# EAGLE design main (EAGLE 9.3.0)
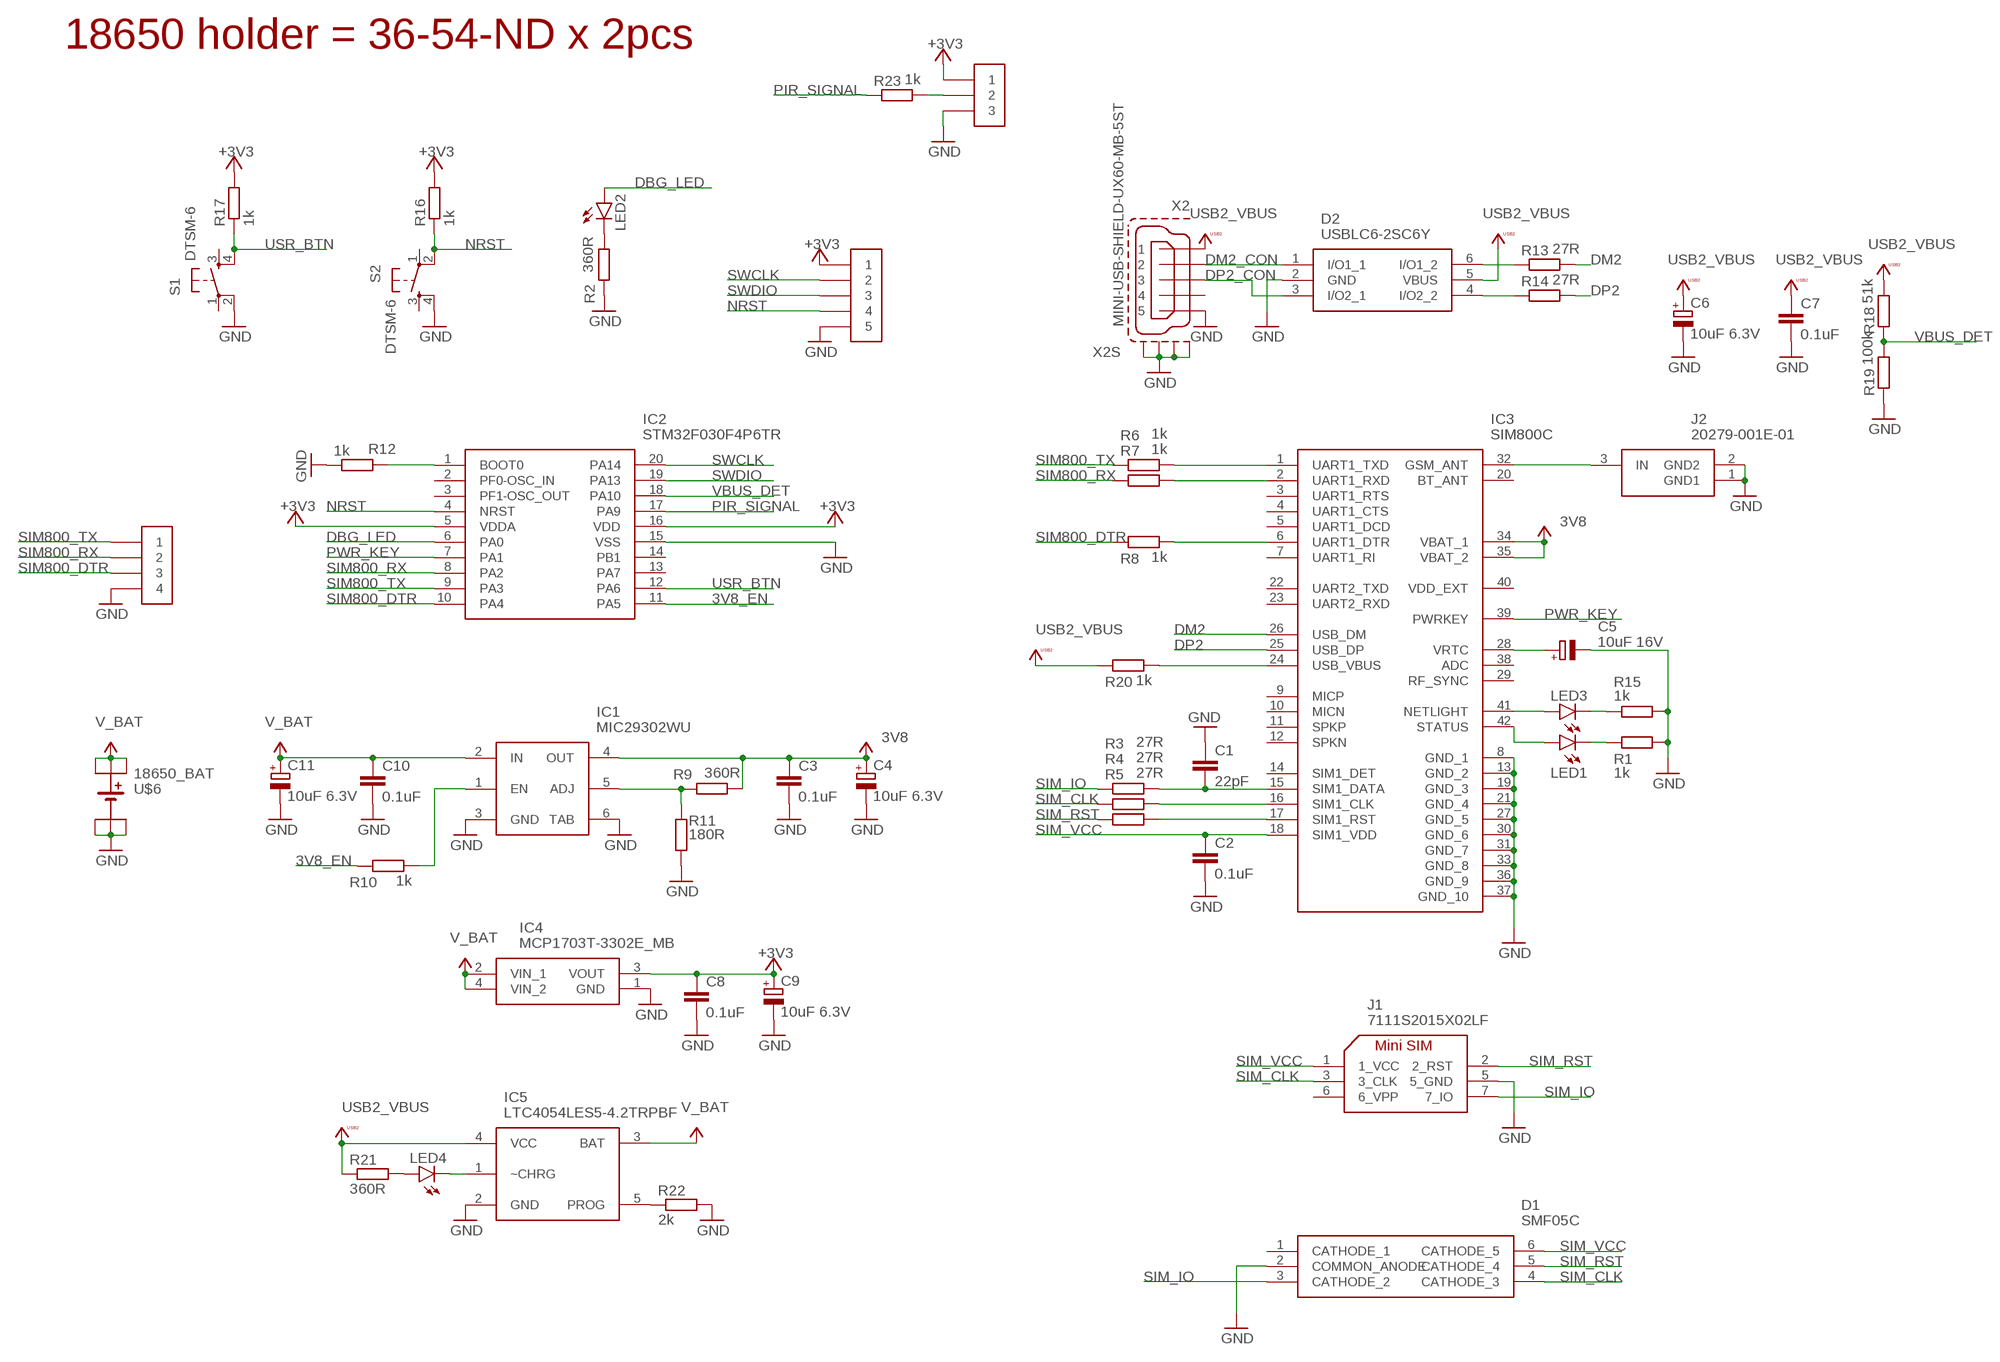
[diagram p0: schematic, sheet 1]

## Parts
C1  22pF  C-EUC0805  [C0805]
C2  0.1uF  C-EUC0805  [C0805]
C3  0.1uF  C-EUC0805  [C0805]
C4  10uF 6.3V  CPOL-EUSMCC  [SMC_C]
C5  10uF 16V  CPOL-EUSMCC  [SMC_C]
C6  10uF 6.3V  CPOL-EUSMCC  [SMC_C]
C7  0.1uF  C-EUC0805  [C0805]
C8  0.1uF  C-EUC0805  [C0805]
C9  10uF 6.3V  CPOL-EUSMCC  [SMC_C]
C10  0.1uF  C-EUC0805  [C0805]
C11  10uF 6.3V  CPOL-EUSMCC  [SMC_C]
D1  SMF05C  [SOT65P210X110-6N]
D2  USBLC6-2SC6Y  [SOT95P280X145-6N]
IC1  MIC29302WU  [MIC29302WU]
IC2  STM32F030F4P6TR  [SOP65P640X120-20N]
IC3  SIM800C  [SIM800C]
IC4  MCP1703T-3302E_MB  [SOT-89(MB)]
IC5  LTC4054LES5-4.2TRPBF  [SOT95P280X100-5N]
J1  7111S2015X02LF  [7111S2015X02LF]
J2  20279-001E-01  [20279-001E-01]
LED1  LEDCHIPLED_0805  [CHIPLED_0805]
LED2  LEDCHIPLED_0805  [CHIPLED_0805]
LED3  LEDCHIPLED_0805  [CHIPLED_0805]
LED4  LEDCHIPLED_0805  [CHIPLED_0805]
R1  1k  R-EU_R0805  [R0805]
R2  360R  R-EU_R0805  [R0805]
R3  27R  R-EU_R0805  [R0805]
R4  27R  R-EU_R0805  [R0805]
R5  27R  R-EU_R0805  [R0805]
R6  1k  R-EU_R0805  [R0805]
R7  1k  R-EU_R0805  [R0805]
R8  1k  R-EU_R0805  [R0805]
R9  360R  R-EU_R0805  [R0805]
R10  1k  R-EU_R0805  [R0805]
R11  180R  R-EU_R0805  [R0805]
R12  1k  R-EU_R0805  [R0805]
R13  27R  R-EU_R0805  [R0805]
R14  27R  R-EU_R0805  [R0805]
R15  1k  R-EU_R0805  [R0805]
R16  1k  R-EU_R0805  [R0805]
R17  1k  R-EU_R0805  [R0805]
R18  51k  R-EU_R0805  [R0805]
R19  100k  R-EU_R0805  [R0805]
R20  1k  R-EU_R0805  [R0805]
R21  360R  R-EU_R0805  [R0805]
R22  2k  R-EU_R0805  [R0805]
R23  1k  R-EU_R0805  [R0805]
S1  DTSM-6  [DTSM-6]
S2  DTSM-6  [DTSM-6]
U$5  1R_4P  [1R_4P]
U$6  18650_BAT  [18650_BAT]
U$12  1R_5P  [1R_5P]
U$15  1R_3P  [1R_3P]
X2  MINI-USB-SHIELD-UX60-MB-5ST  [UX60-MB-5ST]

## Nets
3V8: C3.1 C4.+ IC1.4(OUT) IC3.34(VBAT_1) IC3.35(VBAT_2) R9.2
3V8_EN: IC2.11(PA5) R10.1
+3V3: C8.1 C9.+ IC2.5(VDDA) IC2.16(VDD) IC4.3(VOUT) R16.2 R17.2 U$12.P$1 U$15.P$1
DBG_LED: IC2.6(PA0) LED2.A
DM2: IC3.26(USB_DM) R13.2
DM2_CON: D2.1(I/O1_1) X2.2
DP2: IC3.25(USB_DP) R14.2
DP2_CON: D2.3(I/O2_1) X2.3
GND: C1.1 C2.2 C3.2 C4.- C5.- C6.- C7.2 C8.2 C9.- C10.2 C11.- D1.2(COMMON_ANODE) D2.2(GND) IC1.3(GND) IC1.6(TAB) IC2.15(VSS) IC3.8(GND_1) IC3.13(GND_2) IC3.19(GND_3) IC3.21(GND_4) IC3.27(GND_5) IC3.30(GND_6) IC3.31(GND_7) IC3.33(GND_8) IC3.36(GND_9) IC3.37(GND_10) IC4.1(GND) IC5.2(GND) J1.5(5_GND) J2.1(GND1) J2.2(GND2) R1.2 R2.1 R11.1 R12.2 R15.2 R19.1 R22.2 S1.2 S2.4 U$5.P$4 U$6.4 U$6.5 U$6.6 U$12.P$5 U$15.P$3 X2.5 X2.M1(S1) X2.M2(S2) X2.M3(S3) X2.M4(S4)
N$1: IC3.41(NETLIGHT) LED3.A
N$2: LED3.C R15.1
N$3: IC3.42(STATUS) LED1.A
N$4: LED1.C R1.1
N$5: IC3.32(GSM_ANT) J2.3(IN)
N$6: C5.+ IC3.28(VRTC)
N$7: C1.2 IC3.15(SIM1_DATA) R3.2
N$8: IC3.16(SIM1_CLK) R4.2
N$9: IC3.17(SIM1_RST) R5.2
N$10: IC2.1(BOOT0) R12.1
N$11: IC3.1(UART1_TXD) R6.2
N$12: IC3.2(UART1_RXD) R7.2
N$13: IC3.6(UART1_DTR) R8.2
N$14: IC1.1(EN) R10.2
N$15: D2.6(I/O1_2) R13.1
N$16: IC1.5(ADJ) R9.1 R11.2
N$17: LED2.C R2.2
N$18: IC3.24(USB_VBUS) R20.2
N$19: D2.4(I/O2_2) R14.1
N$20: LED4.A R21.2
N$21: IC5.1(~CHRG) LED4.C
N$22: IC5.5(PROG) R22.1
N$23: R23.2 U$15.P$2
NRST: IC2.4(NRST) R16.1 S2.2 U$12.P$4
PIR_SIGNAL: IC2.17(PA9) R23.1
PWR_KEY: IC2.7(PA1) IC3.39(PWRKEY)
SIM800_DTR: IC2.10(PA4) R8.1 U$5.P$3
SIM800_RX: IC2.8(PA2) R7.1 U$5.P$2
SIM800_TX: IC2.9(PA3) R6.1 U$5.P$1
SIM_CLK: D1.4(CATHODE_3) J1.3(3_CLK) R4.1
SIM_IO: D1.3(CATHODE_2) J1.7(7_IO) R3.1
SIM_RST: D1.5(CATHODE_4) J1.2(2_RST) R5.1
SIM_VCC: C2.1 D1.6(CATHODE_5) IC3.18(SIM1_VDD) J1.1(1_VCC)
SWCLK: IC2.20(PA14) U$12.P$2
SWDIO: IC2.19(PA13) U$12.P$3
USB2_VBUS: C6.+ C7.1 D2.5(VBUS) IC5.4(VCC) R18.2 R20.1 R21.1 X2.1
USR_BTN: IC2.12(PA6) R17.1 S1.4
V_BAT: C10.1 C11.+ IC1.2(IN) IC4.2(VIN_1) IC4.4(VIN_2) IC5.3(BAT) U$6.1 U$6.2 U$6.3
VBUS_DET: IC2.18(PA10) R18.1 R19.2
Unconnected: D1.1(CATHODE_1) IC2.2(PF0-OSC_IN) IC2.3(PF1-OSC_OUT) IC2.13(PA7) IC2.14(PB1) IC3.3(UART1_RTS) IC3.4(UART1_CTS) IC3.5(UART1_DCD) IC3.7(UART1_RI) IC3.9(MICP) IC3.10(MICN) IC3.11(SPKP) IC3.12(SPKN) IC3.14(SIM1_DET) IC3.20(BT_ANT) IC3.22(UART2_TXD) IC3.23(UART2_RXD) IC3.29(RF_SYNC) IC3.38(ADC) IC3.40(VDD_EXT) J1.6(6_VPP) S1.1 S1.3 S2.1 S2.3 X2.4

## Notes on the sheet
- 18650 holder = 36-54-ND x 2pcs

## Library data of the parts
C1-C3 C7 C8 C10 = rcl:C-EU: CAPACITOR, European symbol; SPICEPREFIX: C
C4-C6 C9 C11 = rcl:CPOL-EU: POLARIZED CAPACITOR, European symbol; SPICEPREFIX: C
D1 = SMF05C:SMF05C: SEMTECH - SMF05C - DIODE, TVS, 5 CH, BIDIR, 5V, SC70 Source: Datasheet <https://componentsearchengine.com/Datasheets/2/SMF05C.pdf>; DESCRIPTION: SEMTECH - SMF05C - DIODE, TVS, 5 CH, BIDIR, 5V, SC70; HEIGHT: 1.1mm; MANUFACTURER_NAME: SEMTECH; MANUFACTURER_PART_NUMBER: SMF05C
D2 = USBLC6-2SC6Y:USBLC6-2SC6Y: Low Cap. ESD Protection Auto SOT-23-6 STMicroelectronics USBLC6-2SC6Y, Dual Uni-Directional TVS Diode Array, 6-Pin SOT-23 Source: Datasheet <https://componentsearchengine.com/Datasheets/1/USBLC6-2SC6Y.pdf>; DESCRIPTION: Low Cap. ESD Protection Auto SOT-23-6 STMicroelectronics USBLC6-2SC6Y, Dual Uni-Directional TVS Diode Array, 6-Pin SOT-23; HEIGHT: 1.45mm; MANUFACTURER_NAME: STMicroelectronics; MANUFACTURER_PART_NUMBER: USBLC6-2SC6Y; MOUSER_PART_NUMBER: 511-USBLC6-2SC6Y; MOUSER_PRICE-STOCK: https://www.mouser.com/Search/Refine.aspx?Keyword=511-USBLC6-2SC6Y; RS_PART_NUMBER: 1655549; RS_PRICE-STOCK: http://uk.rs-online.com/web/p/products/1655549
IC1 = MIC29302WU:MIC29302WU: Microchip MIC29302WU, LDO Regulator, 3A Adjustable, 1.25 26 V, +/-1% 5-Pin D2PAK Source: Datasheet <http://ww1.microchip.com/downloads/en/DeviceDoc/20005685A.pdf>; DESCRIPTION: Microchip MIC29302WU, LDO Regulator, 3A Adjustable, 1.25 26 V, +/-1% 5-Pin D2PAK; HEIGHT: 4mm; MANUFACTURER_NAME: Microchip; MANUFACTURER_PART_NUMBER: MIC29302WU; MOUSER_PART_NUMBER: 998-MIC29302WU; RS_PART_NUMBER: 9101607P; RS_PRICE-STOCK: http://uk.rs-online.com/web/p/products/9101607P
IC2 = STM32F030F4P6TR:STM32F030F4P6TR: 32-Bit MCU Cortex-M0 16K Flash TSSOP20 32-Bit MCU Cortex-M0 16K Flash TSSOP20 Source: Datasheet <http://www.st.com/web/en/resource/technical/document/datasheet/DM00088500.pdf>; ALLIED_NUMBER: 70521133; ALLIED_PRICE-STOCK: http://www.alliedelec.com/stmicroelectronics-stm32f030f4p6tr/70521133/; DESCRIPTION: 32-Bit MCU Cortex-M0 16K Flash TSSOP20 32-Bit MCU Cortex-M0 16K Flash TSSOP20; HEIGHT: 1.2mm; MANUFACTURER_NAME: STMicroelectronics; MANUFACTURER_PART_NUMBER: STM32F030F4P6TR; MOUSER_PART_NUMBER: 511-STM32F030F4P6TR; MOUSER_PRICE-STOCK: https://www.mouser.com/Search/Refine.aspx?Keyword=511-STM32F030F4P6TR; RS_PART_NUMBER: 1688744; RS_PRICE-STOCK: http://uk.rs-online.com/web/p/products/1688744
IC3 = sim800c:SIM800C: Quad-band GSM/GPRS wireless module Source: Datasheet <http://www.sabreadv.com/wp-content/uploads/SIM800C_Hardware_Design_V1.00.pdf>; DESCRIPTION: Quad-band GSM/GPRS wireless module; HEIGHT: mm; MANUFACTURER_NAME: SIMCOM; MANUFACTURER_PART_NUMBER: sim800c
IC4 = MCP1703T-3302E_MB:MCP1703T-3302E_MB: LDO Low Iq 250mA 16V 3.3V 2% SOT89 Microchip MCP1703T-3302E/MB, LDO Voltage Regulator, 250mA, 3.3 V 2%, 2.7 16 Vin, 3-Pin SOT-89 Source: Datasheet <http://ww1.microchip.com/downloads/en/DeviceDoc/22049f.pdf>; ALLIED_NUMBER: 70047986; ALLIED_PRICE-STOCK: https://www.alliedelec.com/microchip-technology-inc-mcp1703t-3302e-mb/70047986/; DESCRIPTION: LDO Low Iq 250mA 16V 3.3V 2% SOT89 Microchip MCP1703T-3302E/MB, LDO Voltage Regulator, 250mA, 3.3 V 2%, 2.7 16 Vin, 3-Pin SOT-89; HEIGHT: mm; MANUFACTURER_NAME: Microchip; MANUFACTURER_PART_NUMBER: MCP1703T-3302E/MB; MOUSER_PART_NUMBER: 579-MCP1703T-3302EMB; MOUSER_PRICE-STOCK: https://www.mouser.com/Search/Refine.aspx?Keyword=579-MCP1703T-3302EMB; RS_PART_NUMBER: 9122916; RS_PRICE-STOCK: http://uk.rs-online.com/web/p/products/9122916
IC5 = LTC4054LES5-4.2TRPBF:LTC4054LES5-4.2TRPBF: Standalone Linear Li-Ion Battery Charger with Thermal Regulation Source: Datasheet; DESCRIPTION: Standalone Linear Li-Ion Battery Charger with Thermal Regulation; HEIGHT: mm; MANUFACTURER_NAME: Linear Technology; MANUFACTURER_PART_NUMBER: LTC4054LES5-4.2TRPBF
J1 = 7111S2015X02LF:7111S2015X02LF: Amphenol FCI Horizontal Surface Mount Memory & SIM Card Connector, with Solder Termination Source: Datasheet <http://portal.fciconnect.com/Comergent//fci/drawing/vjw54355.pdf>; ALLIED_NUMBER: 70248487; ALLIED_PRICE-STOCK: https://www.alliedelec.com/amphenol-fci-7111s2015x02lf/70248487/; DESCRIPTION: Amphenol FCI Horizontal Surface Mount Memory & SIM Card Connector, with Solder Termination; HEIGHT: mm; MANUFACTURER_NAME: FCI; MANUFACTURER_PART_NUMBER: 7111S2015X02LF; MOUSER_PART_NUMBER: 649-7111S2015X02LF; MOUSER_PRICE-STOCK: https://www.mouser.com/Search/Refine.aspx?Keyword=649-7111S2015X02LF; RS_PART_NUMBER: 1708857; RS_PRICE-STOCK: http://uk.rs-online.com/web/p/products/1708857
J2 = 20279-001E-01:20279-001E-01: I-Pex Straight 50 Surface Mount UHF Connector, jack, Solder Termination, Coaxial Source: Datasheet <http://uk.rs-online.com/web/p/products/7138874>; DESCRIPTION: I-Pex Straight 50 Surface Mount UHF Connector, jack, Solder Termination, Coaxial; HEIGHT: mm; MANUFACTURER_NAME: I-Pex; MANUFACTURER_PART_NUMBER: 20279-001E-01; RS_PART_NUMBER: 7138874P; RS_PRICE-STOCK: http://uk.rs-online.com/web/p/products/7138874P
LED1-LED4 = led:LED: LED OSRAM: - CHIPLED LG R971, LG N971, LY N971, LG Q971, LY Q971, LO R971, LY R971 LH N974, LH R974 LS Q976, LO Q976, LY Q976 LO Q996 - Hyper CHIPLED LW Q18S LB Q993, LB Q99A, LB R99A - SideLED LS A670, LO A670, LY A670, LG A670, LP A670 LB A673, LV A673, LT A673, LW A673 LH A674 LY A675 LS A676, LA A676, LO A676, LY A676, LW A676 LS A679, LY A679, LG A679 - Hyper Micro SIDELED® LS Y876, LA Y876, LO Y876, LY Y876 LT Y87S - SmartLED LW L88C, LW L88S LB L89C, LB L89S, LG L890 LS L89K, LO L89K, LY L89K LS L896, LA L896, LO L896, LY L896 - TOPLED LS T670, LO T670, LY T670, LG T670, LP T670 LSG T670, LSP T670, LSY T670, LOP T670, LYG T670 LG T671, LOG T671, LSG T671 LB T673, LV T673, LT T673, LW T673 LH T674 LS T676, LA T676, LO T676, LY T676, LB T676, LH T676, LSB T676, LW T676 LB T67C, LV T67C, LT T67C, LS T67K, LO T67K, LY T67K, LW E67C LS E67B, LA E67B, LO E67B, LY E67B, LB E67C, LV E67C, LT E67C LW T67C LS T679, LY T679, LG T679 LS T770, LO T770, LY T770, LG T770, LP T770 LB T773, LV T773, LT T773, LW T773 LH T774 LS E675, LA E675, LY E675, LS T675 LS T776, LA T776, LO T776, LY T776, LB T776 LHGB T686 LT T68C, LB T68C - Hyper Mini TOPLED® LB M676 - Mini TOPLED Santana® LG M470 LS M47K, LO M47K, LY M47K Source: http://www.osram.convergy.de LUXEON: - LUMILED® LXK2-PW12-R00, LXK2-PW12-S00, LXK2-PW14-U00, LXK2-PW14-V00 LXK2-PM12-R00, LXK2-PM12-S00, LXK2-PM14-U00 LXK2-PE12-Q00, LXK2-PE12-R00, LXK2-PE12-S00, LXK2-PE14-T00, LXK2-PE14-U00 LXK2-PB12-K00, LXK2-PB12-L00, LXK2-PB12-M00, LXK2-PB14-N00, LXK2-PB14-P00, LXK2-PB14-Q00 LXK2-PR12-L00, LXK2-PR12-M00, LXK2-PR14-Q00, LXK2-PR14-R00 LXK2-PD12-Q00, LXK2-PD12-R00, LXK2-PD12-S00 LXK2-PH12-R00, LXK2-PH12-S00 LXK2-PL12-P00, LXK2-PL12-Q00, LXK2-PL12-R00 Source: www.luxeon.com KINGBRIGHT: KA-3528ASYC Source: www.kingbright.com
R1-R23 = rcl:R-EU_: RESISTOR, European symbol; SPICEPREFIX: R
S1 S2 = switch-tact:DTSM-6
U$5 = PLS PLD pins:1R_4P
U$6 = 18650_holder:18650_BAT
U$12 = PLS PLD pins:1R_5P
U$15 = PLS PLD pins:1R_3P
X2 = 10033526-N3212MLF:MINI-USB-SHIELD-: MINI USB B CONN You can use either component with this footprint: http://files.edac.net/690-005-299-043.pdf https://www.amphenol-icc.com/media/wysiwyg/files/drawing/10033526.pdf; OC_FARNELL: unknown; OC_NEWARK: unknown

## Board
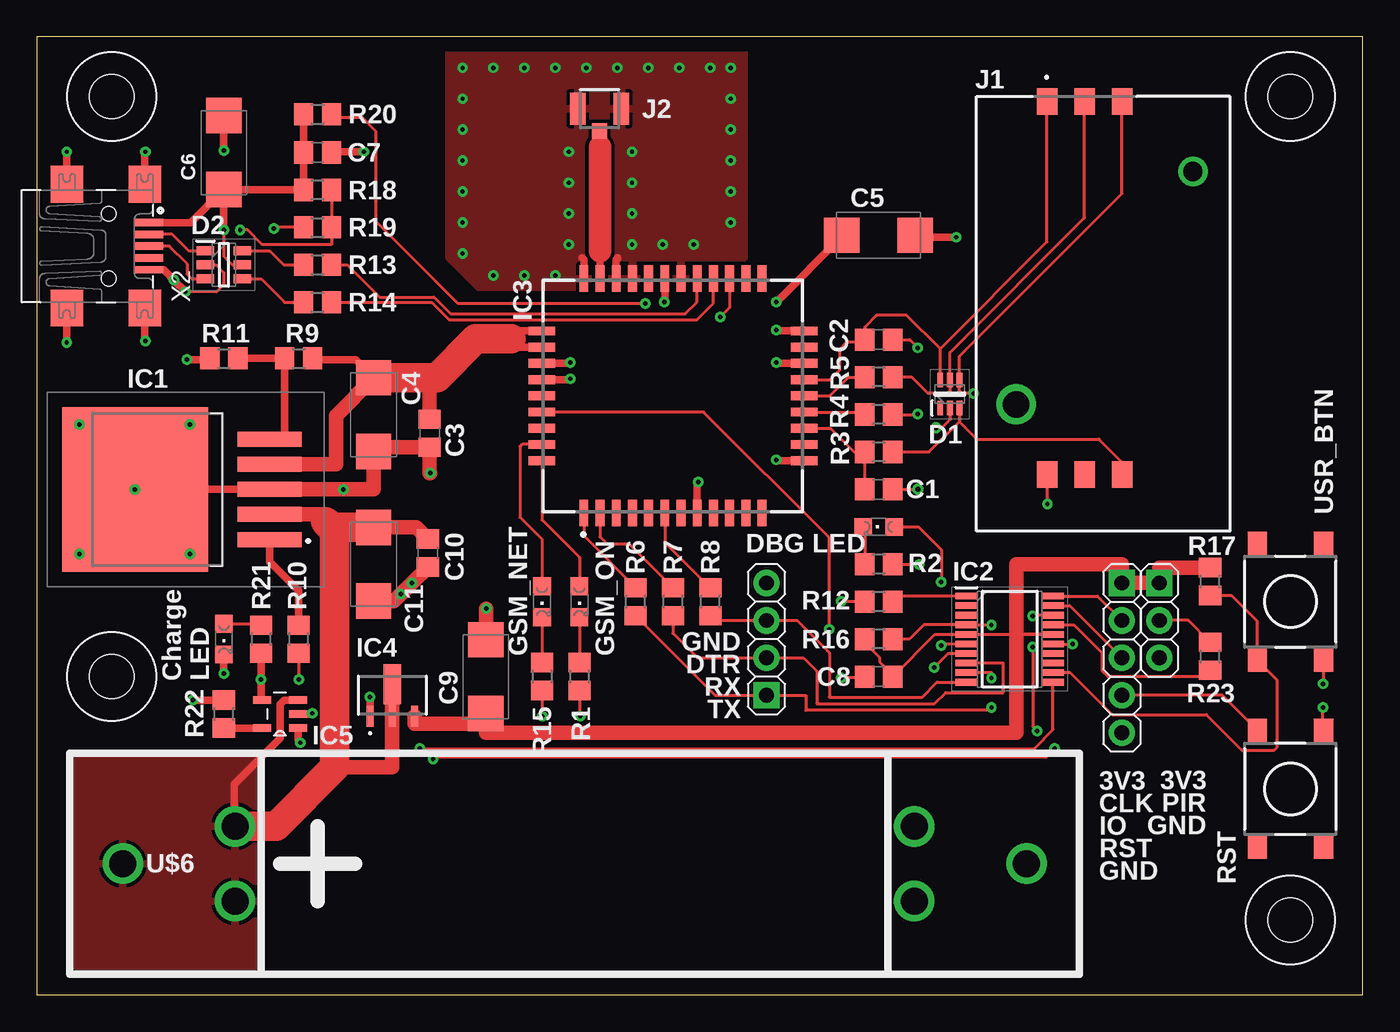
[diagram p1: board, top side]
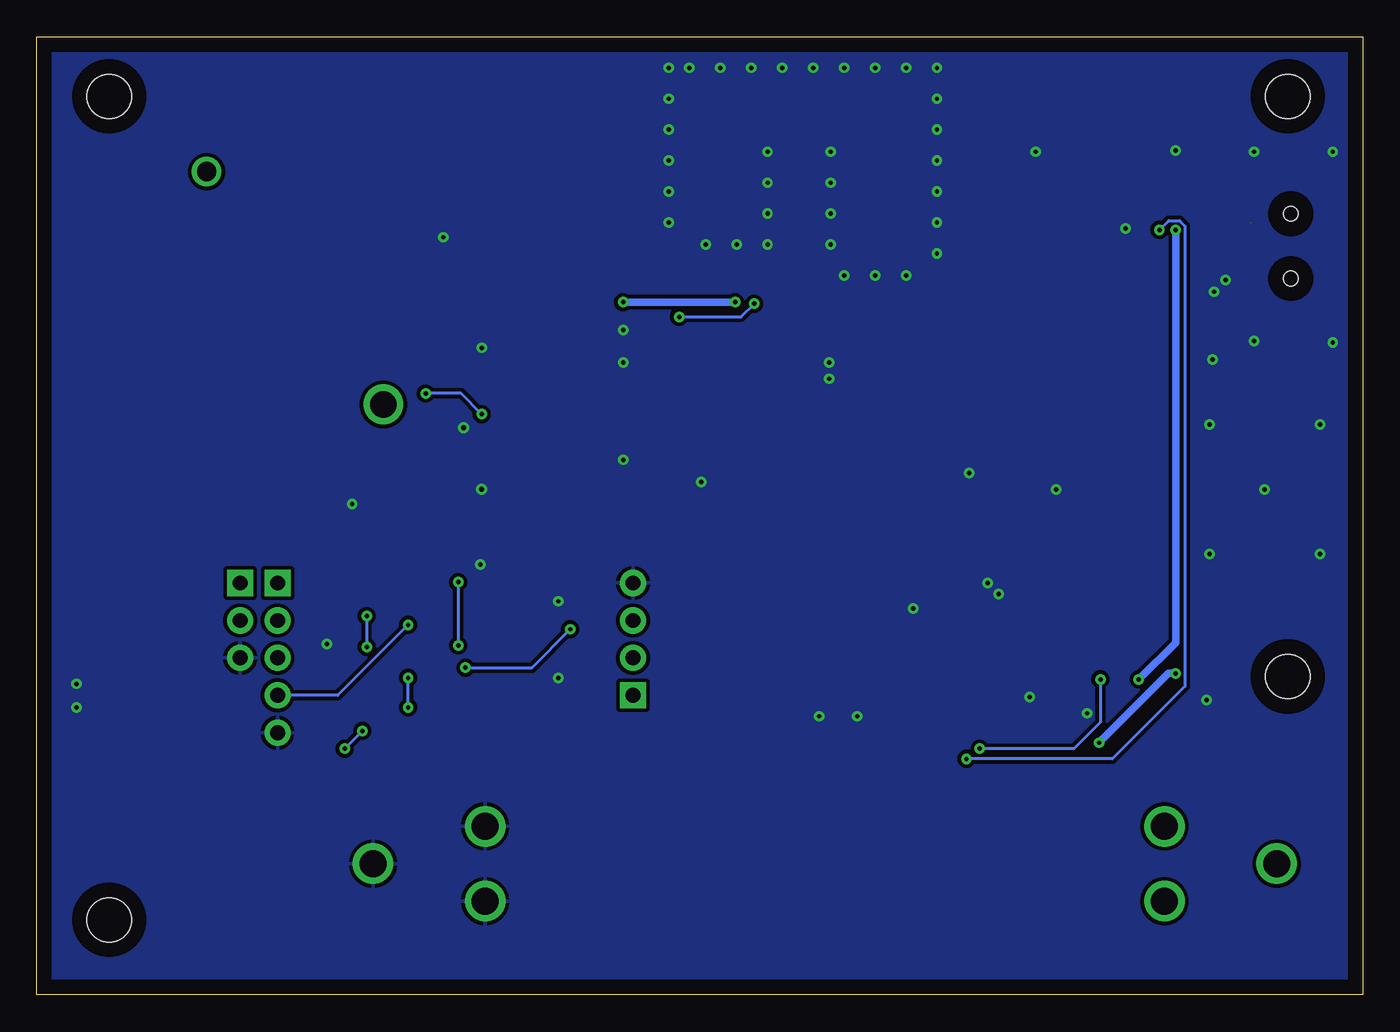
[diagram p2: board, bottom side, seen from below]

Size 90 x 65 mm. Coordinates in mm from the lower left corner, seen from the top.
Outline: 0,0 90,0 90,65 0,65 0,0
Copper layers (1*16): Top 0.035mm / dielectric 1.5mm / Bottom 0.035mm
Design rules "default *": minimum track width 6mil, minimum drill 0.35mm, track to track 6mil, track to pad 6mil, pad to pad 6mil, via to via 6mil, smd to smd 6mil, copper to edge 40mil, drill to drill 6mil, minimum pad ring 10mil, minimum via ring 8mil, stop-mask expansion 4mil, vias tented up to drill 0.35mm, thermal gap 10mil
Holes 3 mm at 5.08,21.59 85.09,5.08 5.08,60.96 85.09,60.96

### Footprints (pad centres in the part's own frame; a part is rotated, then mirrored left to right if it is on the bottom)
C0805 = smd 1.3 x 1.5: 1 -0.95,0; 2 0.95,0
SMC_C = smd 2.4 x 2.4: + -2.5,0; - 2.5,0
SOT65P210X110-6N = smd 1 x 0.4: 1 -0.95,0.65; 2 -0.95,0; 3 -0.95,-0.65; 4 0.95,-0.65; 5 0.95,0; 6 0.95,0.65
SOT95P280X145-6N = smd 1.2 x 0.6: 1 -1.25,0.95; 2 -1.25,0; 3 -1.25,-0.95; 4 1.25,-0.95; 5 1.25,0; 6 1.25,0.95
MIC29302WU = smd 1.02 x 4.32: 1 -3.4,-12; 2 -1.7,-12; 3 0,-12; 4 1.7,-12; 5 3.4,-12 | smd 11.18 x 9.91: 6 0,-2.855
SOP65P640X120-20N = smd 1.475 x 0.45: 1 -2.938,2.925; 2 -2.938,2.275; 3 -2.938,1.625; 4 -2.938,0.975; 5 -2.938,0.325; 6 -2.938,-0.325; 7 -2.938,-0.975; 8 -2.938,-1.625; 9 -2.938,-2.275; 10 -2.938,-2.925; 11 2.938,-2.925; 12 2.938,-2.275; 13 2.938,-1.625; 14 2.938,-0.975; 15 2.938,-0.325; 16 2.938,0.325; 17 2.938,0.975; 18 2.938,1.625; 19 2.938,2.275; 20 2.938,2.925
SIM800C = smd 1.8 x 0.6: 1 -7.95,6.05; 2 -7.95,4.95; 3 -7.95,3.85; 4 -7.95,2.75; 5 -7.95,1.65; 6 -7.95,0.55; 7 -7.95,-0.55; 8 -7.95,-1.65; 9 -7.95,-2.75; 10 -7.95,-3.85; 11 -7.95,-4.95; 12 -7.95,-6.05; 22 7.95,-6.05; 23 7.95,-4.95; 24 7.95,-3.85; 25 7.95,-2.75; 26 7.95,-1.65; 27 7.95,-0.55; 28 7.95,0.55; 29 7.95,1.65; 30 7.95,2.75; 31 7.95,3.85; 32 7.95,4.95; 33 7.95,6.05 | smd 0.6 x 1.8: 13 -4.4,-8.9; 14 -3.3,-8.9; 15 -2.2,-8.9; 16 -1.1,-8.9; 17 0,-8.9; 18 1.1,-8.9; 19 2.2,-8.9; 20 3.3,-8.9; 21 4.4,-8.9; 34 4.4,8.9; 35 3.3,8.9; 36 2.2,8.9; 37 1.1,8.9; 38 0,8.9; 39 -1.1,8.9; 40 -2.2,8.9; 41 -3.3,8.9; 42 -4.4,8.9
SOT-89(MB) = smd 0.48 x 1.4: 1 -1.5,-1.425; 3 1.5,-1.425 | smd 0.48 x 1.525: 2 0,-1.363 | smd 1.2 x 2.725: 4 0,0.76
SOT95P280X100-5N = smd 1.219 x 0.508: 1 -1.219,0.94; 2 -1.219,0; 3 -1.219,-0.94; 4 1.219,-0.94; 5 1.219,0.94
7111S2015X02LF = smd 1.4 x 1.8: 1 -3.81,-0.35; 2 -1.27,-0.35; 3 1.27,-0.35; 5 -3.81,-25.65; 6 -1.27,-25.65; 7 1.27,-25.65 | drill 1.3 pad 2: H1 6.09,-5.1 | drill 1.8 pad 2.65: H2 -5.91,-20.9
20279-001E-01 = smd 2.2 x 1.05: 1 0,1.475; 2 0,-1.475 | smd 1.05 x 1: 3 1.525,0
CHIPLED_0805 = smd 1.2 x 1.2: A 0,-1.05; C 0,1.05
R0805 = smd 1.3 x 1.5: 1 -0.95,0; 2 0.95,0
DTSM-6 = smd 1.55 x 1.3: 1 -3.975,2.25; 2 3.975,2.25; 3 -3.975,-2.25; 4 3.975,-2.25
1R_4P = drill 1 pad 1.778 square: P$1 0,0 | drill 1 pad 1.778: P$2 2.54,0; P$3 5.08,0; P$4 7.62,0
18650_BAT = drill 1.83 pad 2.75: 1 -1.78,2.54; 2 -1.78,-2.54; 3 -9.4,0; 4 44.325,-2.54; 5 44.325,2.54; 6 51.945,0
1R_5P = drill 1 pad 1.778 square: P$1 0,0 | drill 1 pad 1.778: P$2 2.54,0; P$3 5.08,0; P$4 7.62,0; P$5 10.16,0
1R_3P = drill 1 pad 1.778 square: P$1 0,0 | drill 1 pad 1.778: P$2 2.54,0; P$3 5.08,0
UX60-MB-5ST = smd 2 x 0.5: 1 2.25,1.6; 2 2.25,0.8; 3 2.25,0; 4 2.25,-0.8; 5 2.25,-1.6 | smd 2.2 x 2.5: M1 -3.3,-4.2; M2 -3.3,4.2; M3 2,4.2; M4 2,-4.2 | hole 1: -0.45,2.2; -0.45,-2.2

### Placement (x,y rotation side)
C1  57.15,34.29 180 top
C2  57.15,44.45 0 top
C3  26.67,38.1 270 top
C4  22.86,39.37 270 top
C5  57.13,51.54 0 top
C6  12.7,57.15 90 top
C7  19.05,57.15 0 top
C8  57.15,21.59 180 top
C9  30.48,21.59 90 top
C10  26.54,29.97 270 top
C11  22.86,29.21 270 top
D1  61.97,40.76 90 top
D2  12.7,49.53 0 top
IC1  3.81,34.29 90 top
IC2  66.04,24.13 0 top
IC3  43.18,40.64 90 top
IC4  24.13,20.32 0 top
IC5  16.51,19.05 180 top
J1  72.39,60.96 0 top
J2  38.2,60.12 270 top
LED1  36.83,26.67 180 top
LED2  57.15,31.75 90 top
LED3  34.29,26.67 180 top
LED4  12.7,24.13 180 top
R1  36.83,21.59 270 top
R2  57.15,29.21 180 top
R3  57.15,36.83 180 top
R4  57.15,39.37 180 top
R5  57.15,41.91 180 top
R6  40.64,26.67 90 top
R7  43.18,26.67 90 top
R8  45.72,26.67 90 top
R9  17.78,43.18 0 top
R10  17.78,24.13 90 top
R11  12.7,43.18 0 top
R12  57.15,26.67 180 top
R13  19.05,49.53 0 top
R14  19.05,46.99 0 top
R15  34.29,21.59 270 top
R16  57.15,24.13 180 top
R17  79.64,28.04 90 top
R18  19.05,54.61 180 top
R19  19.05,52.07 0 top
R20  19.06,59.75 0 top
R21  15.24,24.13 90 top
R22  12.7,19.05 90 top
R23  79.64,22.96 90 top
S1  85.09,26.67 270 top
S2  85.09,13.97 90 top
U$5  49.53,20.32 90 top
U$6  15.24,8.89 0 top
U$12  73.66,27.94 270 top
U$15  76.2,27.94 270 top
X2  5.33,50.8 0 top

### Tracks (layer width: path | path; a pad name or v marks a point on that pad's centre or on a via)
3V8
  Top 0.5: IC3.35 31.16,43.94 30.06,45.04 | IC3.34 30.06,45.04 | R9.2 18.81,43.1 21.63,43.1 C4.+ | 30.06,45.04 30.06,44.76 29.8,44.5
  Top 1: IC1.4 20.3,35.99 20.3,39.3 C4.+ | C3.1 26.67,41.37 27.17,41.87
  Top 2: C4.+ 27.17,41.87 29.8,44.5 32.2,44.5
3V8_EN  (via drill 0.3)
  Top 0.2: R10.1 17.78,21.4 v17.8,21.4 | v26,16.7 67.7,16.7 69,18 68.98,18.02 IC2.11
  Bottom 0.2: v17.8,21.4 17.8,18.5 19.6,16.7 v26,16.7
+3V3
  Top 0.2: R16.2 56.2,23.9 57.2,22.9 57.2,22.6 58.1,21.7 C8.1 60.97,24.45 IC2.5 IC2.16 66.56,24.45 66.5,24.4
  Top 1: IC4.3 25.63,18.4 30.48,18.4 C9.+ 30.48,17.77 66.5,17.77 66.5,24.4 66.5,29.2 73.66,29.2 U$12.P$1 U$15.P$1 76.2,28.99 R17.2
DBG_LED  (via drill 0.3)
  Top 0.2: LED2.A 59.85,31.75 61.4,30.2 v61.4,28 | v61.4,23.7 61.51,23.8 IC2.6
  Bottom 0.2: v61.4,28 v61.4,23.7
DM2
  Top 0.2: R13.2 21.07,49.53 23.26,47.34 26.96,47.34 28.1,46.2 44,46.2 44.8,47 44.8,48.56 IC3.26
DM2_CON
  Top 0.2: D2.1 10.32,50.48 9.2,51.6 X2.2
DP2
  Top 0.2: R14.2 26.81,46.99 28,45.8 44.8,45.8 45.93,46.93 IC3.25
DP2_CON
  Top 0.2: D2.3 10.52,48.58 10.2,48.9 10.2,49.6 9,50.8 X2.3
GND  (via drill 0.3, 0.35)
  Top 0.2: C2.2 59.25,44.45 v59.8,43.9 | J1.5 68.58,33.32 v68.6,33.3 | D2.2 12.17,49.53 12.7,49 12.7,48.2 12.2,47.7 v10.1,47.7 | R19.1 16.17,52.07 v16.1,52 | R15.2 v34.29,18.91 v34.3,18.9 | R1.2 36.83,18.97 v36.9,18.9 | R2.1 v59.9,29.2 | R12.2 54.63,26.67 v54.6,26.7 | IC2.15 v70.3,23.8 | S1.2 87.34,21.14 v87.3,21.1 | S2.4 87.3,17.98 v87.3,19.5 | C8.2 56.11,21.5 v54.6,21.5 | D1.2 61.97,39.02 61.42,38.48 v61.02,38.48 | C1.1 v59.8,34.3 | 8.78,49.02 8.78,49.2 X2.5
  Top 0.5: 8.6,49.2 8.78,49.02 v9.3,48.5 v10.1,47.7 | C7.2 arc-90 20.05,57.2 v22.2,57.2 | C6.- v12.7,57.3 | R11.1 arc-90 11.67,43.1 v10.2,43.1 | IC1.6 6.67,38.7 v2.9,38.7 | IC1.6 10.4,38.02 v10.4,38.7 | IC1.6 6.67,33.66 v2.9,29.9 | IC1.6 6.67,33.63 v10.4,29.9 | 10.4,34.2 10.49,34.29 IC1.3 | C3.2 26.8,37.02 | R22.2 v10.6,20 | IC5.2 18.65,19.05 v18.7,19.1 | IC4.1 22.63,20.17 v22.6,20.2 | C5.- 59.77,51.4 v62.4,51.4 | IC3.33 37.13,49.87 37,50 | IC3.31 39.33,49.88 39.4,49.95 39.4,50 | IC3.36 36.14,42.84 v36.2,42.9 | IC3.37 36.14,41.74 v36.2,41.8 | IC3.21 50.26,45.04 v50.2,45.1 | IC3.19 50.26,42.84 v50.2,42.9 | IC3.13 50.26,36.24 v50.2,36.3 | IC3.8 44.83,34.73 v44.9,34.8 | X2.M2 v2.03,57.2 | X2.M3 7.33,57.17 v7.37,57.2 | X2.M1 v2.03,44.25 | X2.M4 7.33,44.38 v7.37,44.35
  Top 1: C11.- 24.23,26.71 v24.71,27.19 v25.46,27.94 C10.2 | IC1.3 v20.8,34.29 22.86,34.29 C4.- 22.86,37.15 C3.2 26.67,35.4 v26.7,35.4 | C9.- 30.48,26.2 v30.5,26.2
  other vias: 6.67,34.29 28.9,62.9 28.9,60.8 28.9,58.7 28.9,56.6 28.9,54.5 28.9,52.4 28.9,50.3 31,48.8 33.1,48.8 35.2,48.8 31,62.9 33.1,62.9 36.1,50.9 36.1,53 36.1,55.1 36.1,57.2 35.2,62.9 37.3,62.9 39.4,62.9 41.5,62.9 43.6,62.9 45.7,62.9 47.1,62.9 47.1,60.8 47.1,58.7 47.1,56.6 47.1,54.5 47.1,52.4 40.4,50.9 40.4,53 40.4,55.1 40.4,57.2 42.5,50.9 44.6,50.9
  pour Top (isolate 0.254): 48,64.6 28,64.6 28,50 30,48 46,48 48,50
  pour Bottom (isolate 0.254): 0,65 0,0 90,0 90,65
N$1
  Top 0.2: IC3.41 32.94,37.34 32.8,37.2 32.8,32.4 34.29,30.91 LED3.A
N$2
  Top 0.2: LED3.C R15.1
N$3
  Top 0.2: IC3.42 34.28,32.22 36.83,29.67 LED1.A
N$4
  Top 0.2: LED1.C R1.1
N$5
  Top 0.5: IC3.32 38.23,50.44 | J2.3 38.23,58.56 38.23,57.54
  Top 1.54: 38.23,50.44 38.23,57.54
N$6  (via drill 0.3)
  Top 0.5: IC3.28 42.63,47.03 v42.6,47 | v50.2,47 54.63,51.43 C5.+
  Bottom 0.5: v42.6,47 v50.2,47
N$7
  Top 0.2: IC3.15 53.86,38.44 55.47,36.83 R3.2 C1.2
N$8
  Top 0.2: IC3.16 56.03,39.54 R4.2
N$9
  Top 0.2: IC3.17 53.84,40.64 55.11,41.91 R5.2
N$10
  Top 0.2: IC2.1 58.48,27.05 R12.1
N$11
  Top 0.2: IC3.1 37.13,31.13 R6.2
N$12
  Top 0.2: IC3.2 38.23,31.07 38.7,30.6 40.2,30.6 R7.2
N$13
  Top 0.2: IC3.6 42.63,30.67 45.68,27.62 R8.2
N$14
  Top 0.5: IC1.1 15.81,29.39 17.78,27.42 R10.2
N$15
  Top 0.2: D2.6 15.82,50.48 16.77,49.53 R13.1
N$16
  Top 0.5: R11.2 R9.1 16.83,37.69 IC1.5
N$17
  Top 0.2: LED2.C 56.2,31.65 R2.2
N$18  (via drill 0.3)
  Top 0.2: IC3.24 47.03,46.63 v46.4,46 | v41.3,46.9 28.6,46.9 23.03,52.47 23.03,58.57 22.1,59.5 20.26,59.5 R20.2
  Bottom 0.2: v46.4,46 42.2,46 v41.3,46.9
N$19
  Top 0.2: D2.4 15.22,48.58 16.81,46.99 R14.1
N$20
  Top 0.2: LED4.A 15.14,25.18 R21.2
N$21  (via drill 0.3)
  Top 0.5: IC5.1 17.73,17.27 v17.9,17.1 | v12.7,21.8 LED4.C
  Bottom 0.5: v17.9,17.1 13.2,21.8 v12.7,21.8
N$22
  Top 0.5: R22.1 IC5.5
N$23
  Top 0.2: R23.2 78.15,25.4 U$15.P$2
NRST  (via drill 0.3)
  Top 0.2: S2.2 80.47,20.32 U$12.P$4 | v64.8,25.1 v64.8,25.11 IC2.4 60.2,25.11 59.23,24.13 R16.1
  Bottom 0.2: v64.8,25.1 69.58,20.32 U$12.P$4
PIR_SIGNAL
  Top 0.2: IC2.17 70.39,25.11 72.3,23.2 72.3,22 72.7,21.6 79.23,21.6 R23.1
PWR_KEY  (via drill 0.3)
  Top 0.2: IC2.7 61.85,23.16 v60.9,22.2 | v53.8,24.8 53.8,31 45.26,39.54 IC3.39
  Bottom 0.2: v60.9,22.2 56.4,22.2 v53.8,24.8
SIM800_DTR
  Top 0.2: R8.1 46.04,25.4 U$5.P$3 51.6,25.4 53.8,23.2 53.8,20.2 60.1,20.2 61.1,21.2 IC2.10
SIM800_RX
  Top 0.2: R7.1 43.18,24.52 44.84,22.86 U$5.P$2 52.04,22.86 52.95,21.95 52.95,19.75 60.95,19.75 61.7,20.5 65.6,20.5 65.6,22.5 IC2.8
SIM800_TX  (via drill 0.3)
  Top 0.2: R6.1 46.04,20.32 U$5.P$1 52.2,20.32 52.2,19.3 64.59,19.3 v64.8,19.5 | v64.8,21.5 64.8,21.86 IC2.9
  Bottom 0.2: v64.8,19.5 v64.8,21.5
SIM_CLK  (via drill 0.3)
  Top 0.2: J1.3 73.66,54.36 62.62,43.32 D1.4 62.62,40.98 62.8,40.8 v63.6,40.8 | R4.1 59.77,39.37 v59.8,39.4
  Bottom 0.2: v59.8,39.4 61.2,40.8 v63.6,40.8
SIM_IO
  Top 0.2: D1.3 62.62,38.88 | J1.7 73.66,36.14 72.1,37.7 63.8,37.7 62.62,38.88 | R3.1 60.57,36.83 62.62,38.88
SIM_RST
  Top 0.2: J1.2 71.12,52.72 61.97,43.57 D1.5 61.97,40.97 61.8,40.8 60.5,40.8 59.39,41.91 R5.1
SIM_VCC
  Top 0.2: D1.6 61.32,43.82 | J1.1 68.58,51.08 61.32,43.82 | 61.32,43.82 59.04,46.1 57,46.1 56.2,45.3 C2.1 56.05,44.3 55,44.3 54.5,43.8 54.5,42.4 53.84,41.74 IC3.18
SWCLK
  Top 0.2: IC2.20 72,27.05 U$12.P$2
SWDIO
  Top 0.2: IC2.19 70.11,26.41 U$12.P$3
USB2_VBUS  (via drill 0.3)  (1 unrouted)
  Top 0.2: v12.7,51.9 12.7,50.1 13.27,49.53 D2.5 | v15.2,21.4 15.24,21.36 15.24,20.04
  Top 0.5: C6.+ 10.45,52.4 | C6.+ 12.74,54.61 R18.2 C7.1 R20.1 | C6.+ v12.7,51.9 | R21.1 15.24,20.04 IC5.4
  Top 0.508: 10.45,52.4 X2.1
  Bottom 0.5: v12.7,51.9 12.7,23.9 v15.2,21.4
USR_BTN
  Top 0.2: IC2.12 70.14,21.86 73,19 79.4,19 81.8,16.6 84,16.6 84.2,16.8 84.2,21.34 S1.4 82.84,25.36 81.11,27.09 R17.1
V_BAT
  Top 0.5: IC5.3 16.79,19.99 16.5,19.7 16.5,17.4 13.4,14.3 13.4,11.49 U$6.1 | IC4.2 24.13,19
  Top 1: IC1.2 19.51,32.59 19.6,32.5 19.6,32.1 | C11.+ 25.75,31.71 C10.1 | IC4.4 24.13,19 24.13,15.43 20.23,15.43
  Top 2: U$6.1 16.23,11.43 20.23,15.43 20.23,31.18 20.76,31.71 C11.+ 19.99,31.71 19.6,32.1
  pour Top: 2.7,15.9 14.8,15.9 14.8,1.9 2.7,1.9
VBUS_DET  (via drill 0.3)
  Top 0.2: R18.1 R19.2 20,50.9 15.3,50.9 14.3,51.9 v13.8,51.9 | IC2.18 67.66,25.75 v67.6,25.7 | v67.6,23.6 67.6,18.2 v67.9,17.9 | v69.1,16.7 68.5,16.1 27,16.1 v26.9,16
  Bottom 0.2: v13.8,51.9 13.17,52.53 12.44,52.53 12.41,52.5 12.4,52.5 12.4,52.49 12.07,52.16 12.07,20.93 17,16 v26.9,16 | v67.6,25.7 v67.6,23.6 | v67.9,17.9 v69.1,16.7

### Text on the board
tNames: USR_BTN | DBG LED | GND / DTR / RX / TX | GSM_NET | GSM_ON | Charge / LED | 3V3 / PIR / GND | 3V3 / CLK / IO / RST / GND | RST
tValues: k | k | k | k
200bmp: WAZZUP 05.06.2019